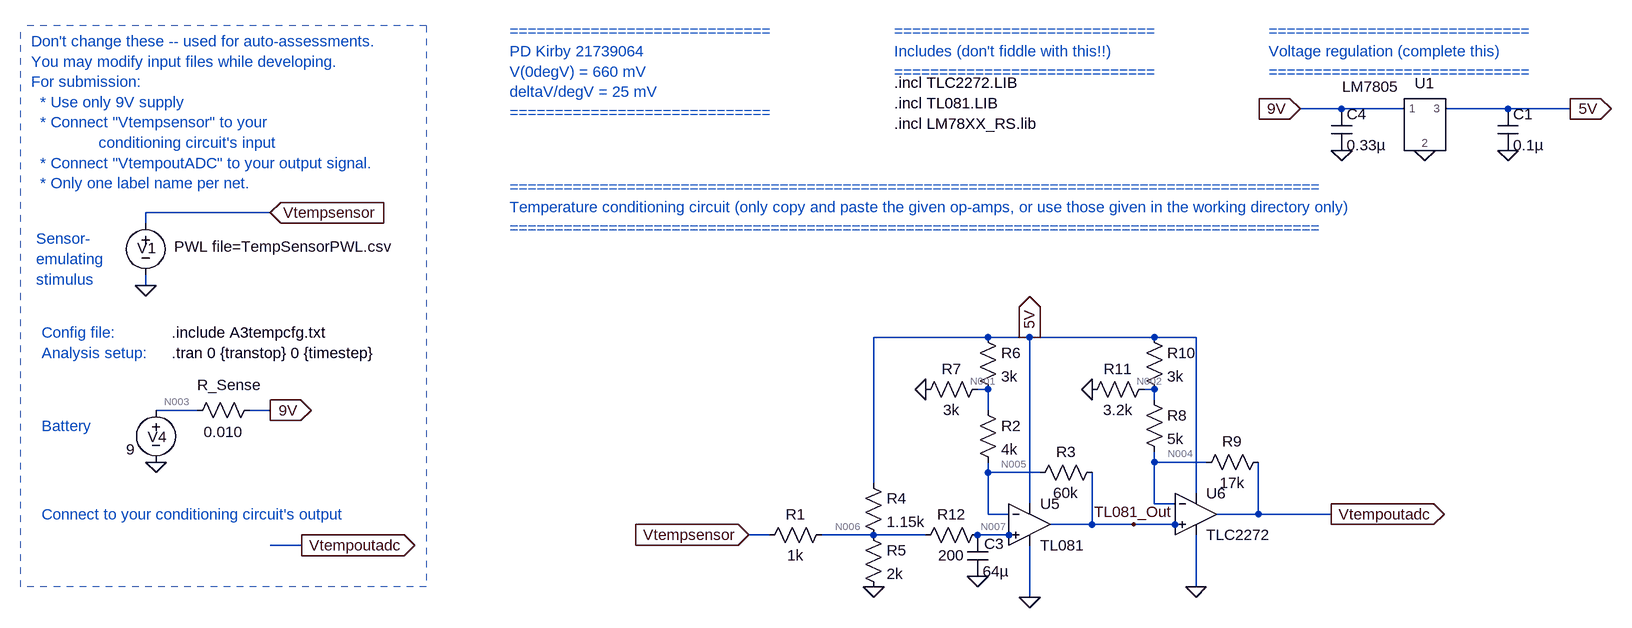
[diagram p0: schematic E344_A3_temp.asc]
E344_A3_temp.asc, the LTspice schematic file:
Version 4
SHEET 1 1824 680
WIRE -272 -1280 -336 -1280
WIRE -176 -1280 -272 -1280
WIRE -16 -1280 -112 -1280
WIRE 80 -1280 -16 -1280
WIRE -1920 -1120 -2112 -1120
WIRE -2112 -1104 -2112 -1120
WIRE -2112 -1008 -2112 -1024
WIRE -816 -928 -992 -928
WIRE -752 -928 -816 -928
WIRE -560 -928 -752 -928
WIRE -496 -928 -560 -928
WIRE -816 -848 -832 -848
WIRE -560 -848 -576 -848
WIRE -560 -832 -560 -848
WIRE -2032 -816 -2096 -816
WIRE -1920 -816 -1952 -816
WIRE -816 -816 -816 -848
WIRE -560 -736 -560 -752
WIRE -480 -736 -560 -736
WIRE -816 -720 -816 -736
WIRE -736 -720 -816 -720
WIRE -992 -704 -992 -928
WIRE -496 -688 -496 -928
WIRE -752 -672 -752 -928
WIRE -560 -672 -560 -736
WIRE -528 -672 -560 -672
WIRE -816 -656 -816 -720
WIRE -784 -656 -816 -656
WIRE -400 -656 -400 -736
WIRE -400 -656 -464 -656
WIRE -288 -656 -400 -656
WIRE -656 -640 -656 -720
WIRE -656 -640 -720 -640
WIRE -592 -640 -656 -640
WIRE -528 -640 -592 -640
WIRE -512 -640 -528 -640
WIRE -1152 -624 -1184 -624
WIRE -992 -624 -1072 -624
WIRE -912 -624 -992 -624
WIRE -784 -624 -832 -624
WIRE -768 -624 -784 -624
WIRE -1872 -608 -1920 -608
WIRE -496 -544 -496 -624
WIRE -752 -528 -752 -608
FLAG -2112 -1008 0
FLAG -1920 -1120 Vtempsensor
IOPIN -1920 -1120 In
FLAG -1920 -816 9V
IOPIN -1920 -816 Out
FLAG -2096 -736 0
FLAG -336 -1280 9V
IOPIN -336 -1280 In
FLAG -1184 -624 Vtempsensor
IOPIN -1184 -624 In
FLAG -144 -1216 0
FLAG 80 -1280 5V
IOPIN 80 -1280 Out
FLAG -288 -656 Vtempoutadc
IOPIN -288 -656 Out
FLAG -1872 -608 Vtempoutadc
IOPIN -1872 -608 Out
FLAG -752 -528 0
FLAG -992 -544 0
FLAG -912 -848 0
FLAG -496 -544 0
FLAG -656 -848 0
FLAG -592 -640 TL081_Out
FLAG -832 -560 0
FLAG -752 -928 5V
IOPIN -752 -928 Out
FLAG -16 -1216 0
FLAG -272 -1216 0
DATAFLAG -256 -656 ""
DATAFLAG -336 -656 ""
SYMBOL voltage -2112 -1120 R0
WINDOW 123 0 0 Left 0
WINDOW 39 0 0 Left 0
WINDOW 3 44 52 Left 2
WINDOW 0 -13 54 Left 2
SYMATTR Value PWL file=TempSensorPWL.csv
SYMATTR InstName V1
SYMBOL voltage -2096 -832 R0
WINDOW 123 24 44 Left 2
WINDOW 39 0 0 Left 0
WINDOW 3 -46 76 Left 2
WINDOW 0 -13 57 Left 2
SYMATTR Value 9
SYMATTR InstName V4
SYMBOL res -1936 -832 R90
WINDOW 0 -7 47 VBottom 2
WINDOW 3 34 56 VTop 2
SYMATTR InstName R_Sense
SYMATTR Value 0.010
SYMBOL LM7805 -144 -1264 R0
WINDOW 3 -83 -66 Top 2
SYMATTR InstName U1
SYMBOL res -1056 -640 R90
WINDOW 0 0 56 VBottom 2
WINDOW 3 32 56 VTop 2
SYMATTR InstName R1
SYMATTR Value 1k
SYMBOL Opamps\\opamp2 -752 -704 R0
SYMATTR InstName U5
SYMATTR Value TL081
SYMBOL res -832 -832 R0
SYMATTR InstName R2
SYMATTR Value 4k
SYMBOL res -640 -736 R90
WINDOW 0 0 56 VBottom 2
WINDOW 3 32 56 VTop 2
SYMATTR InstName R3
SYMATTR Value 60k
SYMBOL res -1008 -720 R0
SYMATTR InstName R4
SYMATTR Value 1.15k
SYMBOL res -1008 -640 R0
SYMATTR InstName R5
SYMATTR Value 2k
SYMBOL res -832 -944 R0
SYMATTR InstName R6
SYMATTR Value 3k
SYMBOL res -816 -864 R90
WINDOW 0 0 56 VBottom 2
WINDOW 3 32 56 VTop 2
SYMATTR InstName R7
SYMATTR Value 3k
SYMBOL Opamps\\opamp2 -496 -720 R0
SYMATTR InstName U6
SYMATTR Value TLC2272
SYMBOL res -576 -848 R0
SYMATTR InstName R8
SYMATTR Value 5k
SYMBOL res -384 -752 R90
WINDOW 0 0 56 VBottom 2
WINDOW 3 32 56 VTop 2
SYMATTR InstName R9
SYMATTR Value 17k
SYMBOL res -576 -944 R0
SYMATTR InstName R10
SYMATTR Value 3k
SYMBOL res -560 -864 R90
WINDOW 0 0 56 VBottom 2
WINDOW 3 32 56 VTop 2
SYMATTR InstName R11
SYMATTR Value 3.2k
SYMBOL cap -848 -624 R0
WINDOW 0 26 14 Left 2
SYMATTR InstName C3
SYMATTR Value 64µ
SYMBOL res -816 -640 R90
WINDOW 0 0 56 VBottom 2
WINDOW 3 32 56 VTop 2
SYMATTR InstName R12
SYMATTR Value 200
SYMBOL cap -32 -1280 R0
SYMATTR InstName C1
SYMATTR Value 0.1µ
SYMBOL cap -288 -1280 R0
SYMATTR InstName C4
SYMATTR Value 0.33µ
TEXT -2072 -904 Left 2 !.tran 0 {transtop} 0 {timestep}
TEXT -2072 -936 Left 2 !.include A3tempcfg.txt
TEXT -2288 -1384 Left 2 ;Don't change these -- used for auto-assessments.\nYou may modify input files while developing.\nFor submission: \n  * Use only 9V supply \n  * Connect "Vtempsensor" to your \n               conditioning circuit's input\n  * Connect "VtempoutADC" to your output signal.\n  * Only one label name per net.
TEXT -2272 -936 Left 2 ;Config file:
TEXT -2272 -904 Left 2 ;Analysis setup:
TEXT -2272 -792 Left 2 ;Battery
TEXT -2280 -1080 Left 2 ;Sensor-\nemulating \nstimulus
TEXT -1552 -1400 Left 2 ;=============================\nPD Kirby 21739064\nV(0degV) = 660 mV\ndeltaV/degV = 25 mV\n=============================
TEXT -1552 -1160 Left 2 ;==========================================================================================\nTemperature conditioning circuit (only copy and paste the given op-amps, or use those given in the working directory only)\n==========================================================================================
TEXT -384 -1400 Left 2 ;=============================\nVoltage regulation (complete this)\n=============================
TEXT -960 -1320 Left 2 !.incl TLC2272.LIB\n.incl TL081.LIB\n.incl LM78XX_RS.lib
TEXT -2272 -656 Left 2 ;Connect to your conditioning circuit's output
TEXT -960 -1400 Left 2 ;=============================\nIncludes (don't fiddle with this!!)\n=============================
LINE Normal -2304 -544 -2304 -1408 1
LINE Normal -1680 -1408 -1680 -544 1
LINE Normal -1680 -544 -2304 -544 1
LINE Normal -1680 -1408 -2304 -1408 1

The netlist it stands for:
* E344_A3_temp.asc
V1 Vtempsensor 0 PWL file=TempSensorPWL.csv
V4 N003 0 9
R_Sense 9V N003 0.010
XU1 9V 0 5V LM7805  ; pins 1 2 3
R1 N006 Vtempsensor 1k
XU5 N007 N005 5V 0 TL081_Out TL081  ; pins In+ In- V+ V- OUT
R2 N001 N005 4k
R3 TL081_Out N005 60k
R4 5V N006 1.15k
R5 N006 0 2k
R6 5V N001 3k
R7 N001 0 3k
XU6 TL081_Out N004 5V 0 Vtempoutadc TLC2272  ; pins In+ In- V+ V- OUT
R8 N002 N004 5k
R9 Vtempoutadc N004 17k
R10 5V N002 3k
R11 N002 0 3.2k
C3 N007 0 64µ
R12 N007 N006 200
C1 5V 0 0.1µ
C4 9V 0 0.33µ
.tran 0 {transtop} 0 {timestep}
.include A3tempcfg.txt
* Don't change these -- used for auto-assessments.
* You may modify input files while developing.
* For submission:
*   * Use only 9V supply
*   * Connect "Vtempsensor" to your
*                conditioning circuit's input
*   * Connect "VtempoutADC" to your output signal.
*   * Only one label name per net.
* Config file:
* Analysis setup:
* Battery
* Sensor-
* emulating
* stimulus
* =============================
* PD Kirby 21739064
* V(0degV) = 660 mV
* deltaV/degV = 25 mV
* =============================
* ==========================================================================================
* Temperature conditioning circuit (only copy and paste the given op-amps, or use those given in the working directory only)
* ==========================================================================================
* =============================
* Voltage regulation (complete this)
* =============================
.incl TLC2272.LIB
.incl TL081.LIB
.incl LM78XX_RS.lib
* Connect to your conditioning circuit's output
* =============================
* Includes (don't fiddle with this!!)
* =============================
.lib LM78XX_RS.lib
.backanno
.end

* Results of the author's LTspice run, read from the files saved beside the schematic
* Operating Point, zero values left out:
*   V(vtempsensor) = 1.554 V
*   V(n003) = 9 V
*   V(9v) = 9 V
*   V(5v) = 5.003 V
*   V(n006) = 2.492 V
*   V(tl081_out) = 2.386 V
*   V(n005) = 2.492 V
*   V(n007) = 2.492 V
*   V(n001) = 2.499 V
*   V(vtempoutadc) = 1.878 V
*   V(n004) = 2.386 V
*   V(n002) = 2.536 V
*   I(R12) = -32.54 pA
*   I(R11) = 792.4 µA
*   I(R10) = 822.3 µA
*   I(R9) = -29.9 µA
*   I(R8) = 29.9 µA
*   I(R7) = 832.9 µA
*   I(R6) = 834.7 µA
*   I(R5) = 1.246 mA
*   I(R4) = 2.184 mA
*   I(R3) = -1.761 µA
*   I(R2) = 1.761 µA
*   I(R1) = 937.7 µA
*   I(R_sense) = -13.79 mA
*   I(V4) = -13.79 mA
*   I(V1) = 937.7 µA
*   Ix(u1:1) = 13.79 mA
*   Ix(u1:2) = -5.02 mA
*   Ix(u1:3) = -8.77 mA
*   Ix(u5:1) = 32.54 pA
*   Ix(u5:2) = 32.54 pA
*   Ix(u5:3) = 2.53 mA
*   Ix(u5:4) = -2.53 mA
*   Ix(u5:5) = 1.761 µA
*   Ix(u6:VCC) = 2.4 mA
*   Ix(u6:VEE) = -2.43 mA
*   Ix(u6:OUT) = 29.9 µA